# Altium schematic sheet RV-3028.SchDoc
size A; SheetNumber: 6; SheetTotal: 6
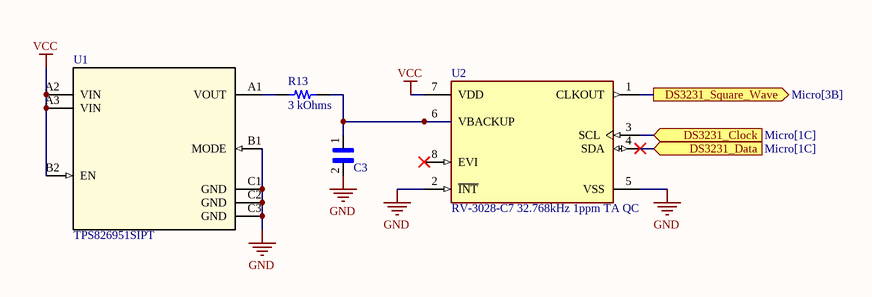
[diagram p0: RV-3028.SchDoc]

## Parts
C3  CPX3225A752D  [CAPCP3225X100N]  (value not drawn)
R13  3 kOhms  [RES 0402_1005]
U1  TPS826951SIPT  [SIP0008A]
U2  RV-3028-C7 32.768kHz 1ppm TA QC  [FP-RV-3028-C7_32_768kHz_1-MFG]

## Ports
DS3231_Clock (in, see Micro[1C]), DS3231_Data (in, see Micro[1C]), DS3231_Square_Wave (out, see Micro[3B])

## Nets
GND: C3.2 U1.B1(MODE) U1.C1(GND) U1.C2(GND) U1.C3(GND) U2.2(~{INT}) U2.5(VSS)
VCC: U1.A2(VIN) U1.A3(VIN) U1.B2(EN) U2.7(VDD)
DS3231_Clock: U2.3(SCL) ; port DS3231_Clock
DS3231_Data: U2.4(SDA) ; port DS3231_Data
DS3231_Square_Wave: U2.1(CLKOUT) ; port DS3231_Square_Wave
NetC3_1: C3.1 R13.2 U2.6(VBACKUP)
NetR13_1: R13.1 U1.A1(VOUT)

Not connected (* = marked no-connect by the designer): U2 8(EVI)*

## Library data of the parts
C3 = CPX3225A752D: 7.5mF (EDLC) Supercapacitor 2.6V 1210 (3225 Metric) 25Ohm @ 1kHz; MF: Seiko Instruments; Purchase-URL: https://pricing.snapeda.com/search/part/CPX3225A752D/?ref=eda; Package: 1210 Seiko; MP: CPX3225A752D; Value: *; Price: None; Availability: Good; SnapEDA_Link: https://www.snapeda.com/parts/CPX3225A752D/Seiko%20Instruments/view-part/2170187/?ref=snap; Check_prices: https://www.snapeda.com/parts/CPX3225A752D/Seiko%20Instruments/view-part/2170187/?ref=eda
R13 = RC0402FR-073KL: RES 3K OHM 1% 1/16W 0402; Manufacturer: Yageo; Power (Watts): 0.063W, 1/16W; Temperature Coefficient: ±100ppm/°C; Part Number: RC0402FR-073KL; Value: 3 kOhms; ComponentLink1Description: Datasheet; ComponentLink1URL: https://www.yageo.com/upload/media/product/productsearch/datasheet/rchip/PYu-RC_Group_51_RoHS_L_10.pdf; ComponentLink2Description: DigiKey Link; ComponentLink2URL: https://www.digikey.com/en/products/detail/yageo/RC0402FR-073KL/2827586; Composition: Thick Film; Device Package: 0402 (1005 Metric); Features: Moisture Resistant; Height - Seated (Max): 0.016" (0.40mm); LastUpdated: 8/4/2022 4:45:37 AM; Lifecycle Status: Active; Minimum Order: 1; Number of Terminations: 2; Operating Temperature: -55°C ~ 155°C; Package / Case: 0402 (1005 Metric); Packaging: CutTape; PartId: 2489; Part Status: Active; Price: 0.01; Resistance: 3 kOhms; Series: RC_L; Size / Dimension: 0.039" L x 0.020" W (1.00mm x 0.50mm); Supplier 1: DigiKey; Supplier Part Number 1: 311-3KLRCT-ND; Supplier Device Package: 0402; Tolerance: ±1%
U1 = TPS826951SIPT: No Description Available; Mfr_Name: Texas Instruments; Type: DEV; RefDes: RefDes; Copyright: Copyright (C) 2022 Ultra Librarian. All rights reserved.; Manufacturer_Part_Number: TPS826951SIPT; Digi-Key_Part_Number_1: 2156-TPS826951SIPT-ND; Digi-Key_Part_Number_2: 296-TPS826951SIPTCT-ND; Digi-Key_Part_Number_3: 296-TPS826951SIPTDKR-ND; Digi-Key_Part_Number_4: 296-TPS826951SIPTTR-ND; Digi-Key_Part_Number_5: TPS826951SIPT-ND
U2 = CMP-226158-000001-1: Real Time Clock Serial 2byte Clock/Calendar/Alarm/Timer/Battery Backup 8-Pin CSMD T/R; Manufacturer: Micro Crystal; Memory Size: 2Bytes; Number Of Outputs: 1; Nominal Supply Current: 0.04uA; Interface: I2C; Max Supply Voltage: 5.5V; Min Supply Voltage: 1.1V; Package: RV-3028-C7 32.768kHz 1ppm TA QC; Lead Free: Yes; RoHS: TRUE; Device Class L1: Integrated Circuits (ICs); Temperature: -40°C to +85°C; ComponentLink2Description: Datasheet; Height: 0.8mm; Octopart: https://octopart.com/rv-3028-c7+32.768khz+1ppm+ta+qc-micro+crystal-98880451; ComponentLink2URL: https://www.microcrystal.com/fileadmin/Media/Products/RTC/Datasheet/RV-3028-C7.pdf; Device Class L2: Clock and Timing; Temperature Range Low: -40°C; Temperature Range High: +85°C; Automotive: No; Device Class L3: Real Time Clocks; Manufacturer Part Number: RV-3028-C7 32.768kHz 1ppm TA QC; Frequency: 32.768kHz; Ambient Temperature Range High: +85°C; Ambient Temperature Range Low: -40°C; Category: IC; Mouser Description: RV-3028-C7 32.768KHZ 1PPM Ta Qc